# EAGLE design TeamI_PDSfinal (EAGLE 9.6.0)
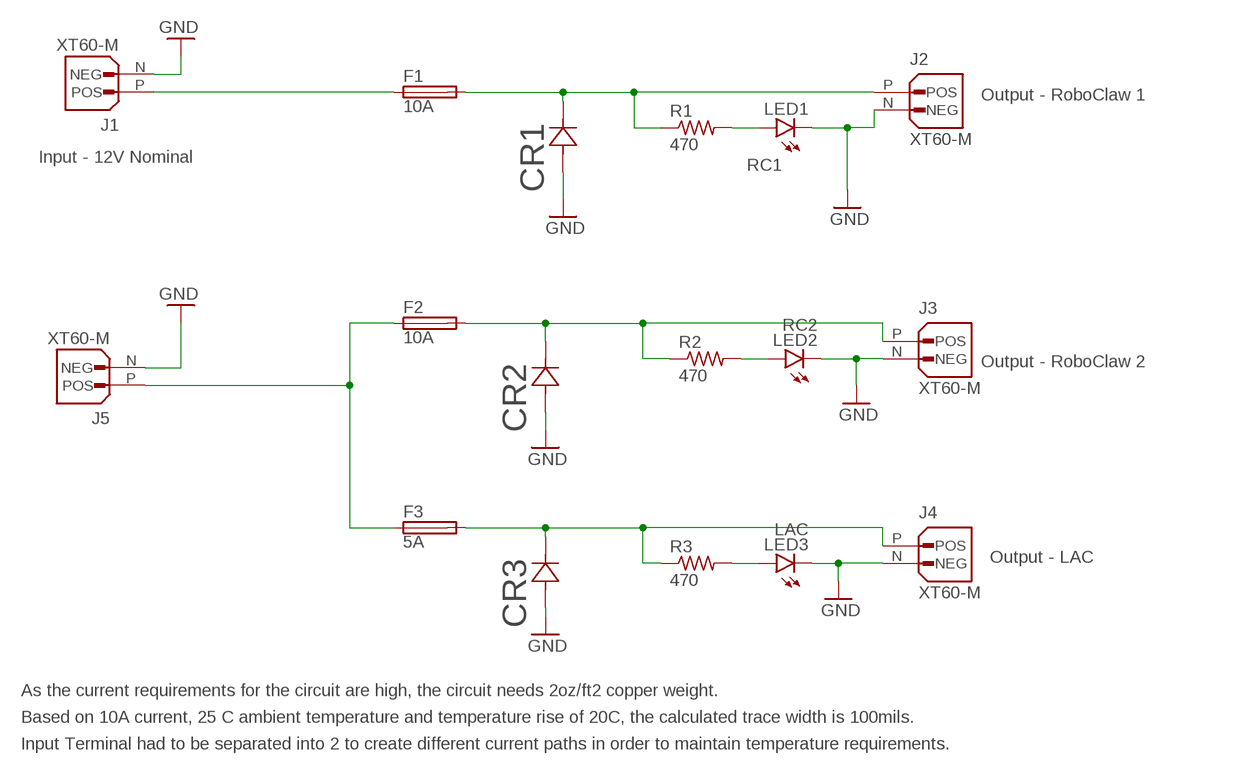
[diagram p0: schematic, sheet 1]

## Parts
CR1  P4SMA16A  [P4SMASERIES_LTF]
CR2  P4SMA16A  [P4SMASERIES_LTF]
CR3  P4SMA16A  [P4SMASERIES_LTF]
F1  10A  TR5  [TR5]
F2  10A  TR5  [TR5]
F3  5A  TE5  [TE5]
J1  XT60-M  [AMASS_XT60-M]
J2  XT60-M  [AMASS_XT60-M]
J3  XT60-M  [AMASS_XT60-M]
J4  XT60-M  [AMASS_XT60-M]
J5  XT60-M  [AMASS_XT60-M]
LED1  RC1  LEDSMT1206  [1206]
LED2  RC2  LEDSMT1206  [1206]
LED3  LAC  LEDSMT1206  [1206]
R1  470  R-US_R1206  [R1206]
R2  470  R-US_R1206  [R1206]
R3  470  R-US_R1206  [R1206]

## Nets
GND: CR1.2 CR2.2 CR3.2 J1.N(NEG) J2.N(NEG) J3.N(NEG) J4.N(NEG) J5.N(NEG) LED1.C LED2.C LED3.C
N$1: CR1.1 F1.2 J2.P(POS) R1.1
N$3: CR3.1 F3.2 J4.P(POS) R3.1
N$4: LED1.A R1.2
N$5: F1.1 J1.P(POS)
N$6: CR2.1 F2.2 J3.P(POS) R2.1
N$7: LED2.A R2.2
N$9: LED3.A R3.2
N$14: F2.1 F3.1 J5.P(POS)

## Notes on the sheet
- Output - RoboClaw 1
- Input - 12V Nominal
- Output - RoboClaw 2
- Output - LAC
- As the current requirements for the circuit are high, the circuit needs 2oz/ft2 copper weight.
- Based on 10A current, 25 C ambient temperature and temperature rise of 20C, the calculated trace width is 100mils.
- Input Terminal had to be separated into 2 to create different current paths in order to maintain temperature requirements.

## Library data of the parts
CR1-CR3 = P4SMA16A:P4SMA16A; COPYRIGHT: Copyright (C) 2025 Ultra Librarian. All rights reserved.; MANUFACTURER_PART_NUMBER: P4SMA16A; MFR_NAME: Littelfuse Inc
F1 F2 = fuse:TR5: FUSE Wickmann; OC_FARNELL: unknown; OC_NEWARK: unknown
F3 = fuse:TE5: FUSE Wickmann; OC_FARNELL: unknown; OC_NEWARK: unknown
J1-J5 = XT60-M:XT60-M: Check availability <https://pricing.snapeda.com/parts/XT60-M/AMASS/view-part?ref=eda>; AVAILABILITY: Not in stock; CHECK_PRICES: https://www.snapeda.com/parts/XT60-M/AMASS/view-part/?ref=eda; DESCRIPTION: Plug; DC supply; XT60; male; PIN: 2; for cable; soldered; 30A; 500V; MF: AMASS; MP: XT60-M; PACKAGE: Package; PRICE: None; SNAPEDA_LINK: https://www.snapeda.com/parts/XT60-M/AMASS/view-part/?ref=snap
LED1-LED3 = led:LED: LED OSRAM: - CHIPLED LG R971, LG N971, LY N971, LG Q971, LY Q971, LO R971, LY R971 LH N974, LH R974 LS Q976, LO Q976, LY Q976 LO Q996 - Hyper CHIPLED LW Q18S LB Q993, LB Q99A, LB R99A - SideLED LS A670, LO A670, LY A670, LG A670, LP A670 LB A673, LV A673, LT A673, LW A673 LH A674 LY A675 LS A676, LA A676, LO A676, LY A676, LW A676 LS A679, LY A679, LG A679 - Hyper Micro SIDELED® LS Y876, LA Y876, LO Y876, LY Y876 LT Y87S - SmartLED LW L88C, LW L88S LB L89C, LB L89S, LG L890 LS L89K, LO L89K, LY L89K LS L896, LA L896, LO L896, LY L896 - TOPLED LS T670, LO T670, LY T670, LG T670, LP T670 LSG T670, LSP T670, LSY T670, LOP T670, LYG T670 LG T671, LOG T671, LSG T671 LB T673, LV T673, LT T673, LW T673 LH T674 LS T676, LA T676, LO T676, LY T676, LB T676, LH T676, LSB T676, LW T676 LB T67C, LV T67C, LT T67C, LS T67K, LO T67K, LY T67K, LW E67C LS E67B, LA E67B, LO E67B, LY E67B, LB E67C, LV E67C, LT E67C LW T67C LS T679, LY T679, LG T679 LS T770, LO T770, LY T770, LG T770, LP T770 LB T773, LV T773, LT T773, LW T773 LH T774 LS E675, LA E675, LY E675, LS T675 LS T776, LA T776, LO T776, LY T776, LB T776 LHGB T686 LT T68C, LB T68C - Hyper Mini TOPLED® LB M676 - Mini TOPLED Santana® LG M470 LS M47K, LO M47K, LY M47K Source: http://www.osram.convergy.de LUXEON: - LUMILED® LXK2-PW12-R00, LXK2-PW12-S00, LXK2-PW14-U00, LXK2-PW14-V00 LXK2-PM12-R00, LXK2-PM12-S00, LXK2-PM14-U00 LXK2-PE12-Q00, LXK2-PE12-R00, LXK2-PE12-S00, LXK2-PE14-T00, LXK2-PE14-U00 LXK2-PB12-K00, LXK2-PB12-L00, LXK2-PB12-M00, LXK2-PB14-N00, LXK2-PB14-P00, LXK2-PB14-Q00 LXK2-PR12-L00, LXK2-PR12-M00, LXK2-PR14-Q00, LXK2-PR14-R00 LXK2-PD12-Q00, LXK2-PD12-R00, LXK2-PD12-S00 LXK2-PH12-R00, LXK2-PH12-S00 LXK2-PL12-P00, LXK2-PL12-Q00, LXK2-PL12-R00 Source: www.luxeon.com KINGBRIGHT: KA-3528ASYC Source: www.kingbright.com
R1-R3 = rcl:R-US_: RESISTOR, American symbol; SPICEPREFIX: R

## Board
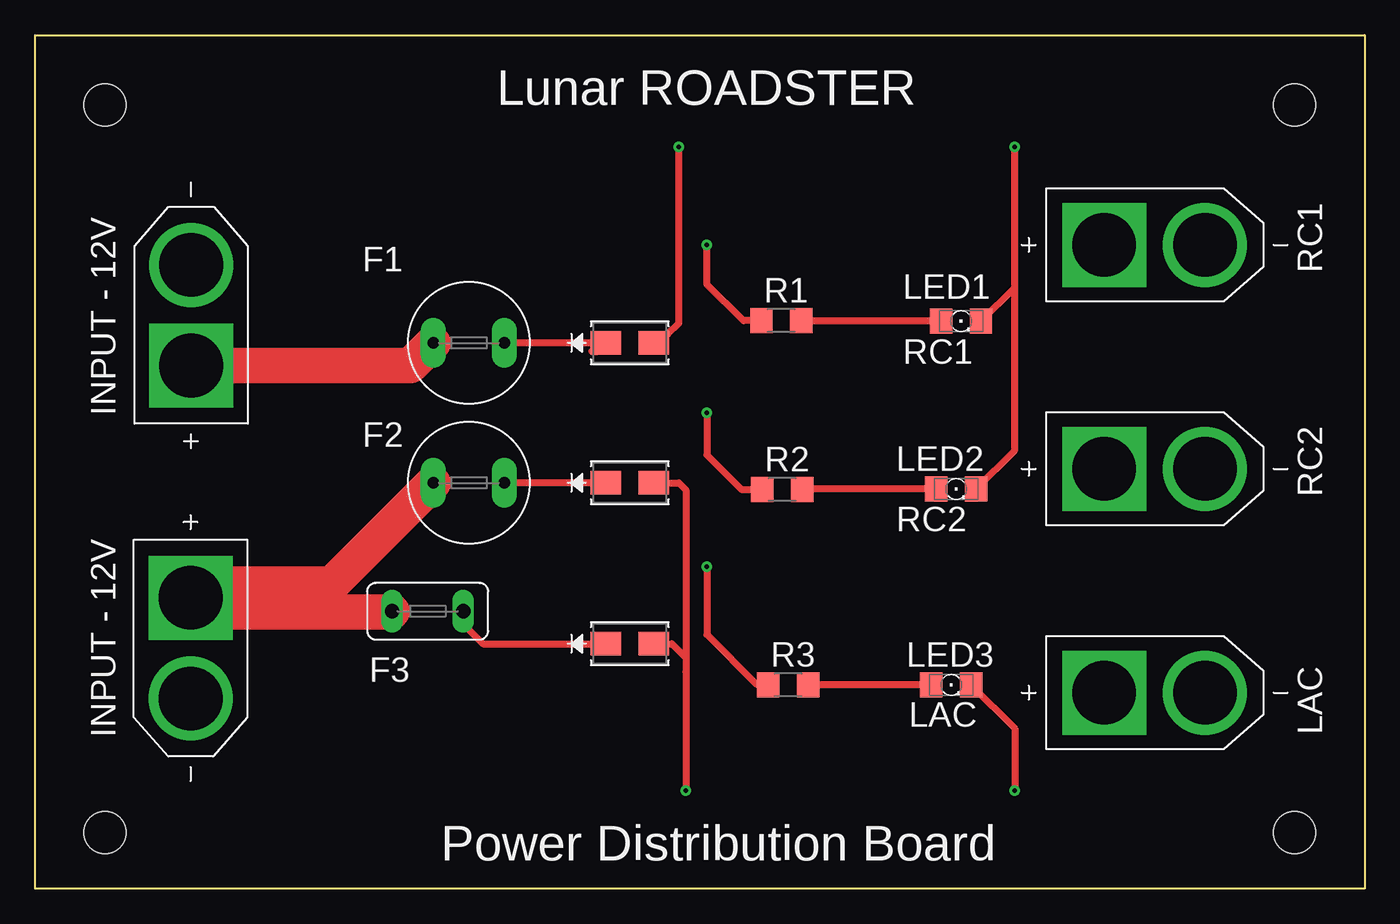
[diagram p1: board, top side]
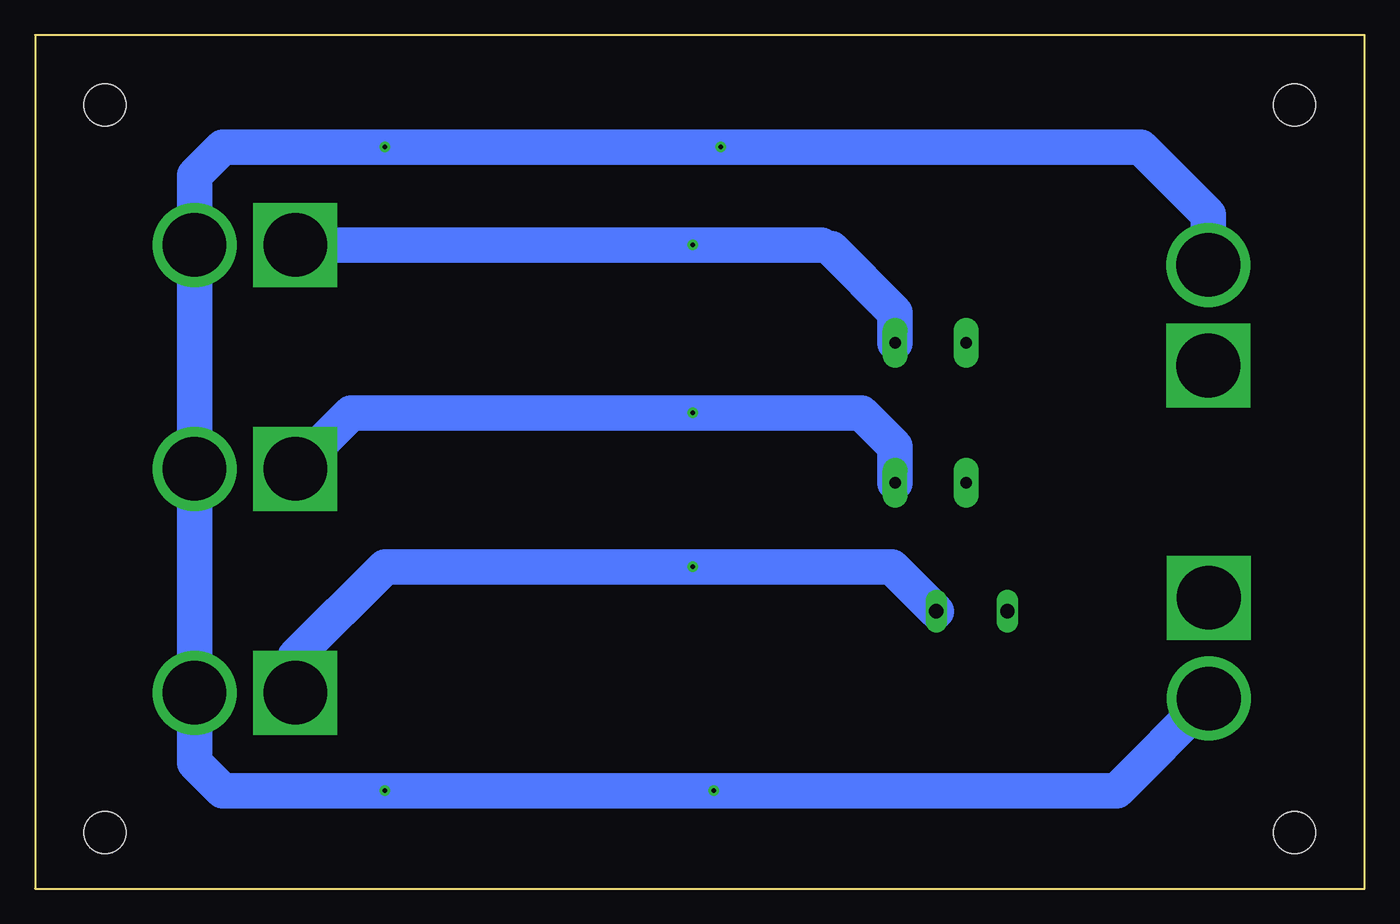
[diagram p2: board, bottom side, seen from below]

Size 95 x 61 mm. Coordinates in mm from the lower left corner, seen from the top.
Outline: 0,61 95,61 95,0 0,0 0,61
Copper layers (1*16): Top 0.035mm / dielectric 1.5mm / Bottom 0.035mm
Design rules "default *": minimum track width 20mil, minimum drill 0.35mm, track to track 6mil, track to pad 6mil, pad to pad 6mil, via to via 6mil, smd to smd 6mil, copper to edge 40mil, drill to drill 6mil, minimum pad ring 10mil, minimum via ring 8mil, stop-mask expansion 4mil, vias tented up to drill 0mil, thermal gap 10mil
Holes 3 mm at 5,56 5,4 90,4 90,56

### Footprints (pad centres in the part's own frame; a part is rotated, then mirrored left to right if it is on the bottom)
P4SMASERIES_LTF = smd 2.184 x 1.651: 1 -1.702,0; 2 1.702,0
TR5 = drill 0.813 pad 1.778 long: 1 -2.54,0; 2 2.54,0
TE5 = drill 1.016 long: 1 -2.54,0; 2 2.54,0
AMASS_XT60-M = drill 4.55 pad 6: N 3.6,0 | drill 4.55 pad 6 square: P -3.6,0
1206 = smd 1.6 x 1.803: A -1.422,0; C 1.422,0
R1206 = smd 1.6 x 1.803: 1 -1.422,0; 2 1.422,0

### Placement (x,y rotation side)
CR1  42.5,39 0 top
CR2  42.5,29 0 top
CR3  42.5,17.5 0 top
F1  31,39 0 top
F2  31,29 0 top
F3  28.06,19.82 0 top
J1  11.16,40.97 90 top
J2  80,46 0 top
J3  80,30 0 top
J4  80,14 0 top
J5  11.12,17.18 270 top
LED1  66.17,40.55 0 top
LED2  65.82,28.55 0 top
LED3  65.47,14.55 0 top
R1  53.33,40.59 0 top
R2  53.39,28.52 0 top
R3  53.82,14.56 0 top

### Tracks (layer width: path | path; a pad name or v marks a point on that pad's centre or on a via)
GND  (via drill 0.35)
  Top 0.508: LED1.C 70,42.96 | 70,42.96 v70,53 | LED2.C 70,31.31 70,42.96 | LED3.C 70,11.44 v70,7 | CR1.2 44.81,39.61 45.2,39.61 46,40.41 v46,53 | CR3.2 45.5,17.5 46.5,16.5 | 46.5,16.5 46.5,15.5 v46.5,7 | CR2.2 46,29 46.5,28.5 46.5,16.5
  Bottom 2.54: J1.N 11.16,48.16 16,53 v46,53 v70,53 81.6,53 83.6,51 J2.N J3.N J4.N 83.6,9 81.6,7 v70,7 v46.5,7 17.7,7 J5.N
N$1  (via drill 0.35)
  Top 0.508: R1.1 50.63,40.59 48,43.21 v48,46 | v48,46 | 39.8,38.39 40.19,38.39 CR1.1 F1.2
  Bottom 0.508: 38.81,46 38.38,46 38.1,45.72
  Bottom 2.54: 38.81,46 v48,46 J2.P | F1.2 33.54,41.16 38.1,45.72
N$3  (via drill 0.35)
  Top 0.508: v48,23 48,18.16 51.6,14.56 R3.1 | F3.2 30.6,18.9 32,17.5 CR3.1
  Bottom 2.54: F3.2 33.78,23 v48,23 70,23 76.4,16.6 J4.P
N$4
  Top 0.508: R1.2 54.79,40.55 LED1.A
N$5
  Top 2.54: F1.1 26.83,37.37 J1.P
N$6  (via drill 0.35)
  Top 0.508: v48,34 48,31 50.48,28.52 R2.1 | 40.62,28.82 CR2.1 F2.2
  Bottom 2.54: J3.P 72.4,34 v48,34 35.94,34 33.54,31.6 F2.2
N$7
  Top 0.508: LED2.A 54.84,28.55 R2.2
N$9
  Top 0.508: R3.2 LED3.A
N$14
  Top 0.508: 24.48,25.02
  Top 2.54: F3.1 25.48,19.78 12.12,19.78 J5.P 12.12,21.78 16.64,21.78 21.24,21.78 24.48,25.02 F2.1

### Text on the board
tNames: Lunar ROADSTER | INPUT - 12V | RC1 | RC1 | RC2 | RC2 | INPUT - 12V | LAC | LAC | Power Distribution Board